# EasyEDA schematic digital clock run4 copy.json
TITLE: Sheet_1; REV: 1.0; Date: 2021-03-11; Sheet: 1/1; Drawn By: QueenOfTheNorth; Company: Your Company
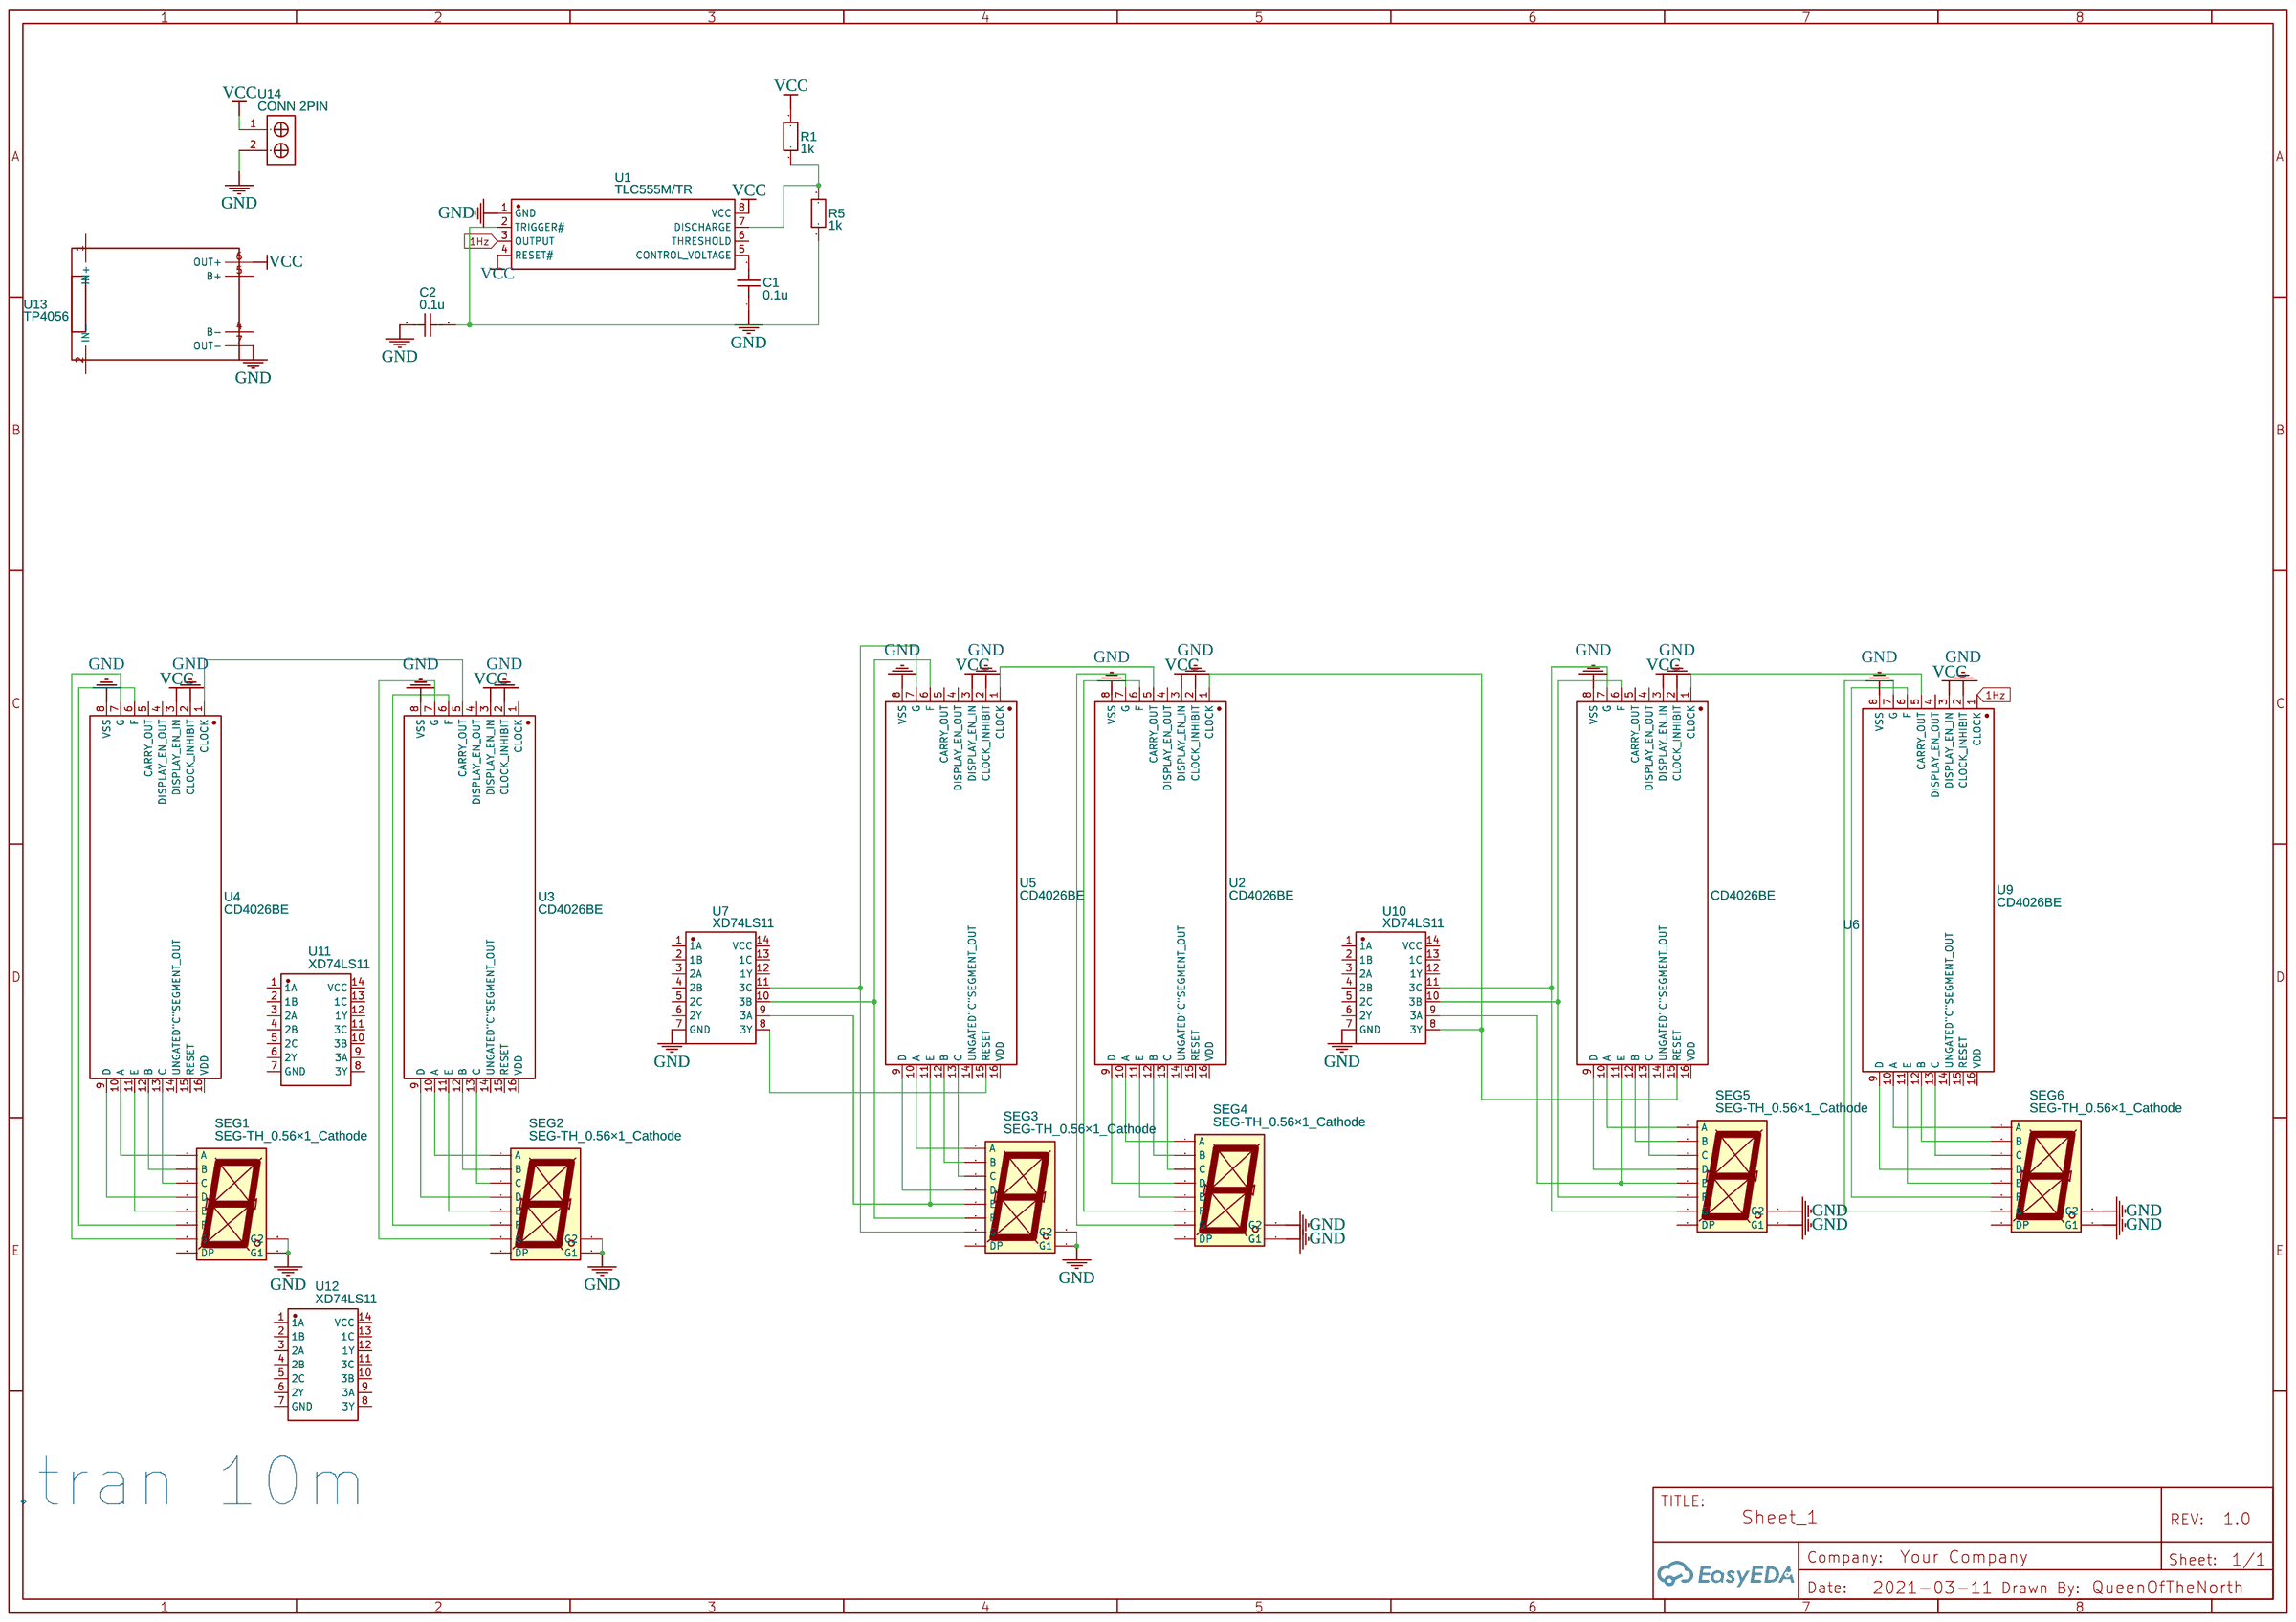
[diagram p0: schematic sheet]

## Parts
C1  0.1u  [C0603]
C2  0.1u  [C0603]
R1  1k  [R0603]
R5  1k  [R0603]
SEG1  SEG-TH_0.56×1_Cathode  [LED-SEG-TH_10P-L12.6-W19.0-P2.54-S15.24-BL]
SEG2  SEG-TH_0.56×1_Cathode  [LED-SEG-TH_10P-L12.6-W19.0-P2.54-S15.24-BL]
SEG3  SEG-TH_0.56×1_Cathode  [LED-SEG-TH_10P-L12.6-W19.0-P2.54-S15.24-BL]
SEG4  SEG-TH_0.56×1_Cathode  [LED-SEG-TH_10P-L12.6-W19.0-P2.54-S15.24-BL]
SEG5  SEG-TH_0.56×1_Cathode  [LED-SEG-TH_10P-L12.6-W19.0-P2.54-S15.24-BL]
SEG6  SEG-TH_0.56×1_Cathode  [LED-SEG-TH_10P-L12.6-W19.0-P2.54-S15.24-BL]
U1  TLC555M/TR  [SOP-8_L4.9-W3.9-P1.27-LS6.0-BL]
U2  CD4026BE  [DIP-16_L20.3-W10.2-P2.54-LS10.2-BL]
U3  CD4026BE  [DIP-16_L20.3-W10.2-P2.54-LS10.2-BL]
U4  CD4026BE  [DIP-16_L20.3-W10.2-P2.54-LS10.2-BL]
U5  CD4026BE  [DIP-16_L20.3-W10.2-P2.54-LS10.2-BL]
U6  CD4026BE  [DIP-16_L20.3-W10.2-P2.54-LS10.2-BL]
U7  XD74LS11  [DIP-14_L19.4-W6.4-P2.54-LS7.6-BL]
U9  CD4026BE  [DIP-16_L20.3-W10.2-P2.54-LS10.2-BL]
U10  XD74LS11  [DIP-14_L19.4-W6.4-P2.54-LS7.6-BL]
U11  XD74LS11  [DIP-14_L19.4-W6.4-P2.54-LS7.6-BL]
U12  XD74LS11  [DIP-14_L19.4-W6.4-P2.54-LS7.6-BL]
U13  TP4056  [TP4056-PROTECT]
U14  CONN 2PIN  [TERMINAL_BLOCK_KF762-3P]

## Library data of the parts
C1 C2 = C_0603_US: Contributor: LCEDA_Lib
R1 R5 = R_0603_EU: Contributor: LCEDA_Lib
SEG1-SEG6 = SEG-TH_0.56×1_Cathode: Manufacturer: 志浩; Supplier Part: C8093; Contributor: LCEDA_01
U1 = TLC555M/TR: Supplier: LCSC; Supplier Part: C383061; Manufacturer: HGSEMI; Contributor: LCSC; Assembly Type: smtWeld; Paste Type: expand
U2-U6 U9 = CD4026BE: Supplier: LCSC; Manufacturer: TI; Supplier Part: C89909; LCSC Assembly: Yes; SMT Type: Extend; Assembly Type: manualWeld; Paste Type: expand
U7 U10-U12 = XD74LS11: Supplier: LCSC; Supplier Part: C521167; Manufacturer: XINLUDA(信路达); Contributor: LCSC
U13 = TP4056: Manufacturer Part: TP4056-protect; link: https://dlnmh9ip6v2uc.cloudfront.net/datasheets/Prototyping/TP4056.pdf; Contributor: quocanhhai
U14 = CONN 2PIN: Manufacturer Part: Terminal Block; Supplier Part: undefined; Contributor: bangnaga

## Nets
GND: C1.1 C2.1 SEG1.3(G1) SEG1.8(G2) SEG2.3(G1) SEG2.8(G2) SEG3.3(G1) SEG3.8(G2) SEG4.3(G1) SEG4.8(G2) SEG5.3(G1) SEG5.8(G2) SEG6.3(G1) SEG6.8(G2) U1.1(GND) U2.2(CLOCK_INHIBIT) U3.2(CLOCK_INHIBIT) U3.8(VSS) U4.2(CLOCK_INHIBIT) U4.8(VSS) U5.2(CLOCK_INHIBIT) U5.8(VSS) U6.2(CLOCK_INHIBIT) U6.8(VSS) U7.7(GND) U9.2(CLOCK_INHIBIT) U9.8(VSS) U10.7(GND) U13.7(OUT-) U14.2
VCC: R1.2 U1.4(RESET#) U1.8(VCC) U2.3(DISPLAY_EN_IN) U3.3(DISPLAY_EN_IN) U4.3(DISPLAY_EN_IN) U5.3(DISPLAY_EN_IN) U6.3(DISPLAY_EN_IN) U9.3(DISPLAY_EN_IN) U13.6(OUT+) U14.1
1Hz: U1.3(OUTPUT) U9.1(CLOCK)
Net-(C1-2): C1.2 U1.5(CONTROL VOLTAGE)
Net-(C2-2): C2.2 R5.1 U1.2(TRIGGER#)
Net-(R1-1): R1.1 R5.2 U1.7(DISCHARGE)
Net-(SEG1-1): SEG1.1(E) U4.11(E)
Net-(SEG1-2): SEG1.2(D) U4.9(D)
Net-(SEG1-4): SEG1.4(C) U4.13(C)
Net-(SEG1-6): SEG1.6(B) U4.12(B)
Net-(SEG1-7): SEG1.7(A) U4.10(A)
Net-(SEG1-9): SEG1.9(F) U4.6(F)
Net-(SEG1-10): SEG1.10(G) U4.7(G)
Net-(SEG2-1): SEG2.1(E) U3.11(E)
Net-(SEG2-2): SEG2.2(D) U3.9(D)
Net-(SEG2-4): SEG2.4(C) U3.13(C)
Net-(SEG2-6): SEG2.6(B) U3.12(B)
Net-(SEG2-7): SEG2.7(A) U3.10(A)
Net-(SEG2-9): SEG2.9(F) U3.6(F)
Net-(SEG2-10): SEG2.10(G) U3.7(G)
Net-(SEG3-1): SEG3.1(E) U5.11(E) U7.9(3A)
Net-(SEG3-2): SEG3.2(D) U5.9(D)
Net-(SEG3-4): SEG3.4(C) U5.13(C)
Net-(SEG3-6): SEG3.6(B) U5.12(B)
Net-(SEG3-7): SEG3.7(A) U5.10(A)
Net-(SEG3-9): SEG3.9(F) U5.6(F) U7.10(3B)
Net-(SEG3-10): SEG3.10(G) U5.7(G) U7.11(3C)
Net-(SEG4-1): SEG4.1(E) U2.11(E)
Net-(SEG4-2): SEG4.2(D) U2.9(D)
Net-(SEG4-4): SEG4.4(C) U2.13(C)
Net-(SEG4-6): SEG4.6(B) U2.12(B)
Net-(SEG4-7): SEG4.7(A) U2.10(A)
Net-(SEG4-9): SEG4.9(F) U2.6(F)
Net-(SEG4-10): SEG4.10(G) U2.7(G)
Net-(SEG5-1): SEG5.1(E) U6.11(E) U10.9(3A)
Net-(SEG5-2): SEG5.2(D) U6.9(D)
Net-(SEG5-4): SEG5.4(C) U6.13(C)
Net-(SEG5-6): SEG5.6(B) U6.12(B)
Net-(SEG5-7): SEG5.7(A) U6.10(A)
Net-(SEG5-9): SEG5.9(F) U6.6(F) U10.10(3B)
Net-(SEG5-10): SEG5.10(G) U6.7(G) U10.11(3C)
Net-(SEG6-1): SEG6.1(E) U9.11(E)
Net-(SEG6-2): SEG6.2(D) U9.9(D)
Net-(SEG6-4): SEG6.4(C) U9.13(C)
Net-(SEG6-6): SEG6.6(B) U9.12(B)
Net-(SEG6-7): SEG6.7(A) U9.10(A)
Net-(SEG6-9): SEG6.9(F) U9.6(F)
Net-(SEG6-10): SEG6.10(G) U9.7(G)
Net-(U2-1): U2.1(CLOCK) U6.15(RESET) U10.8(3Y)
Net-(U2-5): U2.5(CARRY_OUT) U5.1(CLOCK)
Net-(U3-5): U3.5(CARRY_OUT) U4.1(CLOCK)
Net-(U5-15): U5.15(RESET) U7.8(3Y)
Net-(U6-1): U6.1(CLOCK) U9.5(CARRY_OUT)

Not connected (* = marked no-connect by the designer): SEG1 5(DP); SEG2 5(DP); SEG3 5(DP); SEG4 5(DP); SEG5 5(DP); SEG6 5(DP); U1 6(THRESHOLD); U2 4(DISPLAY_EN_OUT) 8(VSS) 14(UNGATED"C"SEGMENT_OUT) 15(RESET) 16(VDD); U3 1(CLOCK) 4(DISPLAY_EN_OUT) 14(UNGATED"C"SEGMENT_OUT) 15(RESET) 16(VDD); U4 4(DISPLAY_EN_OUT) 5(CARRY_OUT) 14(UNGATED"C"SEGMENT_OUT) 15(RESET) 16(VDD); U5 4(DISPLAY_EN_OUT) 5(CARRY_OUT) 14(UNGATED"C"SEGMENT_OUT) 16(VDD); U6 4(DISPLAY_EN_OUT) 5(CARRY_OUT) 14(UNGATED"C"SEGMENT_OUT) 16(VDD); U7 1(1A) 2(1B) 3(2A) 4(2B) 5(2C) 6(2Y) 12(1Y) 13(1C) 14(VCC); U9 4(DISPLAY_EN_OUT) 14(UNGATED"C"SEGMENT_OUT) 15(RESET) 16(VDD); U10 1(1A) 2(1B) 3(2A) 4(2B) 5(2C) 6(2Y) 12(1Y) 13(1C) 14(VCC); U11 1(1A) 2(1B) 3(2A) 4(2B) 5(2C) 6(2Y) 7(GND) 8(3Y) 9(3A) 10(3B) 11(3C) 12(1Y) 13(1C) 14(VCC); U12 1(1A) 2(1B) 3(2A) 4(2B) 5(2C) 6(2Y) 7(GND) 8(3Y) 9(3A) 10(3B) 11(3C) 12(1Y) 13(1C) 14(VCC); U13 1(IN+) 2(IN-) 4(B-) 5(B+)

## Notes on the sheet
- .tran 10m
